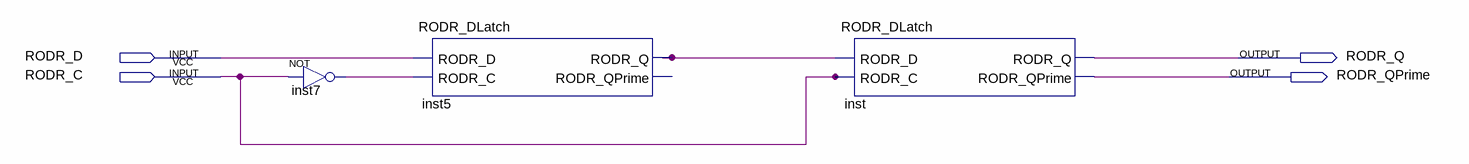
[diagram p0: schematic sheet]
// Quartus schematic RODR_PosEdgeMasSlave_D_FlipFlop.bdf as structural Verilog: 3 symbols, 4 pins
module RODR_PosEdgeMasSlave_D_FlipFlop (
  input  RODR_D,
  input  RODR_C,
  output RODR_Q,
  output RODR_QPrime
);

  wire inst5_rodr_q, inst7_out;

  not inst7 (inst7_out, RODR_C);
  RODR_DLatch inst5 (.RODR_D(RODR_D), .RODR_C(inst7_out), .RODR_Q(inst5_rodr_q));  // open: RODR_QPrime
  RODR_DLatch inst (.RODR_D(inst5_rodr_q), .RODR_C(RODR_C), .RODR_Q(RODR_Q), .RODR_QPrime(RODR_QPrime));
endmodule
